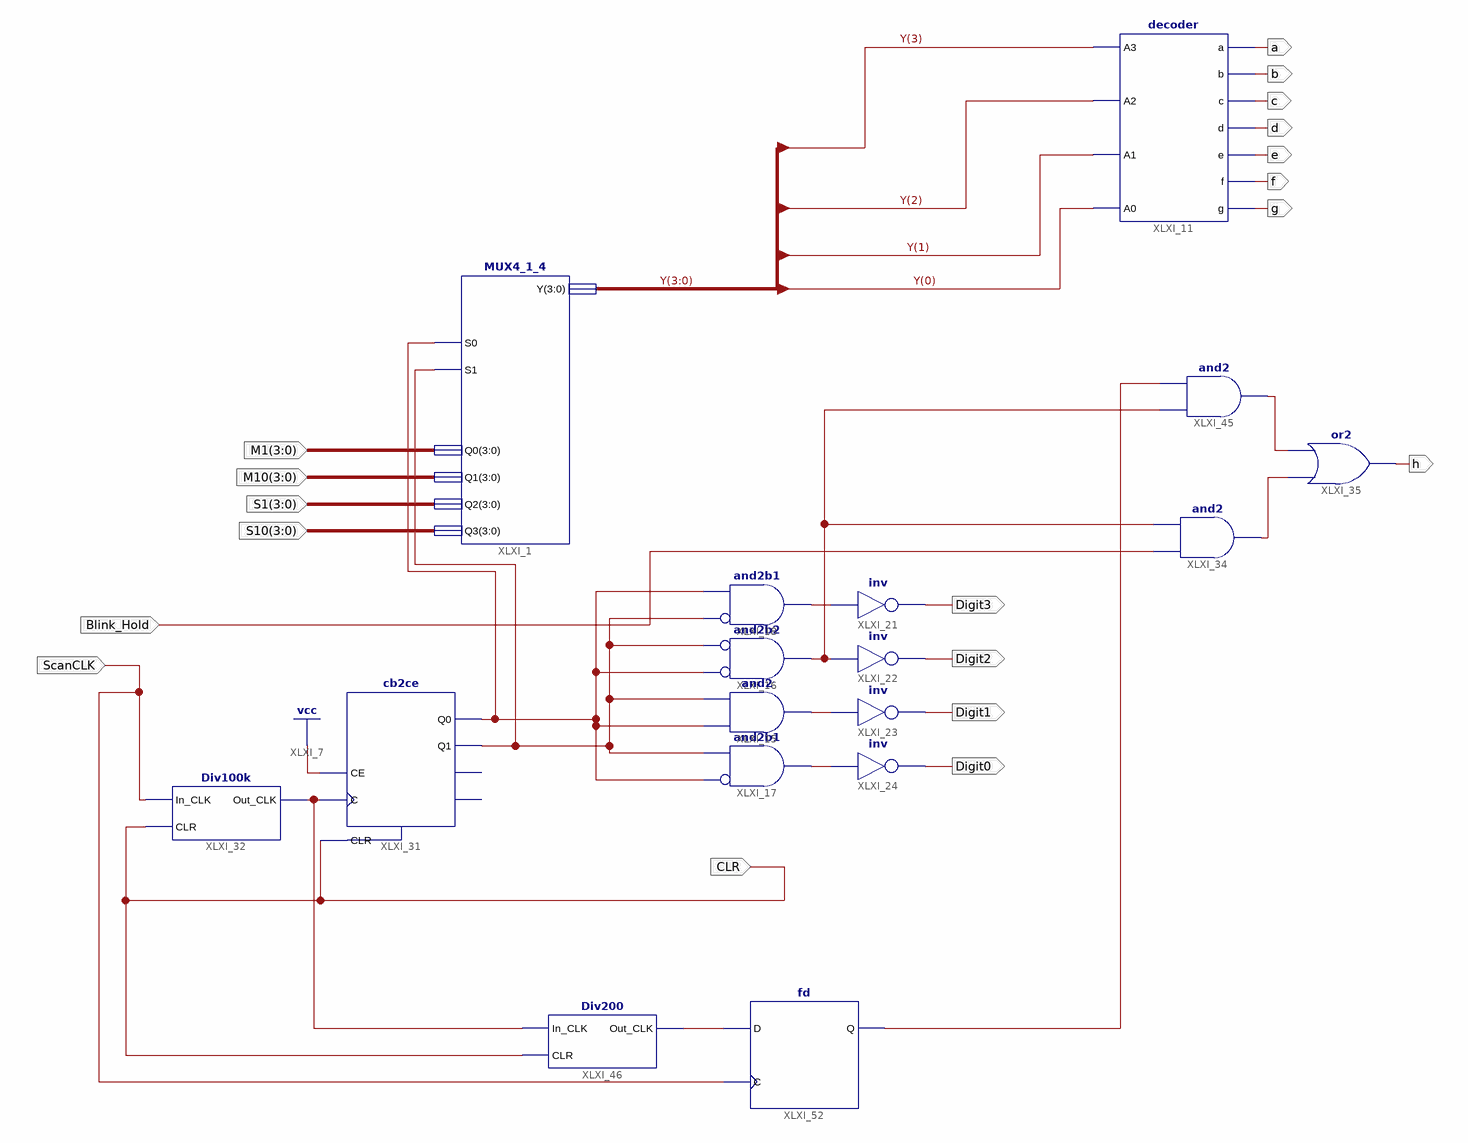
[diagram p0: schematic sheet 1]
// Xilinx ISE schematic DisplayTimer.sch (spartan6) as structural Verilog: 17 symbols, 19 ports
module DisplayTimer (
  input  [3:0] M1,
  input  [3:0] M10,
  input  [3:0] S1,
  input  [3:0] S10,
  input  Blink_Hold,
  input  ScanCLK,
  input  CLR,
  output Digit2,
  output Digit0,
  output Digit3,
  output Digit1,
  output h,
  output g,
  output f,
  output e,
  output d,
  output c,
  output b,
  output a
);

  wire XLXN_28, XLXN_49, XLXN_80, XLXN_82, XLXN_83, XLXN_89, XLXN_94, XLXN_169, XLXN_173, XLXN_175, XLXN_176;
  wire [3:0] Y;

  MUX4_1_4 XLXI_1 (.Q0(M1), .Q1(M10), .S0(XLXN_49), .S1(XLXN_28), .Q2(S1), .Q3(S10), .Y(Y));
  and XLXI_16 (XLXN_175, ~XLXN_49, ~XLXN_28);  // and2b2
  and XLXI_17 (XLXN_83, ~XLXN_49, XLXN_28);  // and2b1
  and XLXI_18 (XLXN_80, ~XLXN_28, XLXN_49);  // and2b1
  and XLXI_15 (XLXN_82, XLXN_49, XLXN_28);
  not XLXI_21 (Digit3, XLXN_80);
  not XLXI_22 (Digit2, XLXN_175);
  not XLXI_23 (Digit1, XLXN_82);
  not XLXI_24 (Digit0, XLXN_83);
  cb2ce XLXI_31 (.C(XLXN_89), .CE(1'b1), .CLR(CLR), .Q0(XLXN_49), .Q1(XLXN_28));  // open: CEO, TC
  Div100k XLXI_32 (.In_CLK(ScanCLK), .Out_CLK(XLXN_89), .CLR(CLR));
  and XLXI_34 (XLXN_94, Blink_Hold, XLXN_175);
  or XLXI_35 (h, XLXN_94, XLXN_169);
  decoder XLXI_11 (.A3(Y[3]), .A2(Y[2]), .A1(Y[1]), .A0(Y[0]), .a(a), .b(b), .c(c), .d(d), .e(e), .f(f), .g(g));
  and XLXI_45 (XLXN_169, XLXN_175, XLXN_176);
  Div200 XLXI_46 (.In_CLK(XLXN_89), .Out_CLK(XLXN_173), .CLR(CLR));
  fd XLXI_52 (.C(ScanCLK), .D(XLXN_173), .Q(XLXN_176));
endmodule
